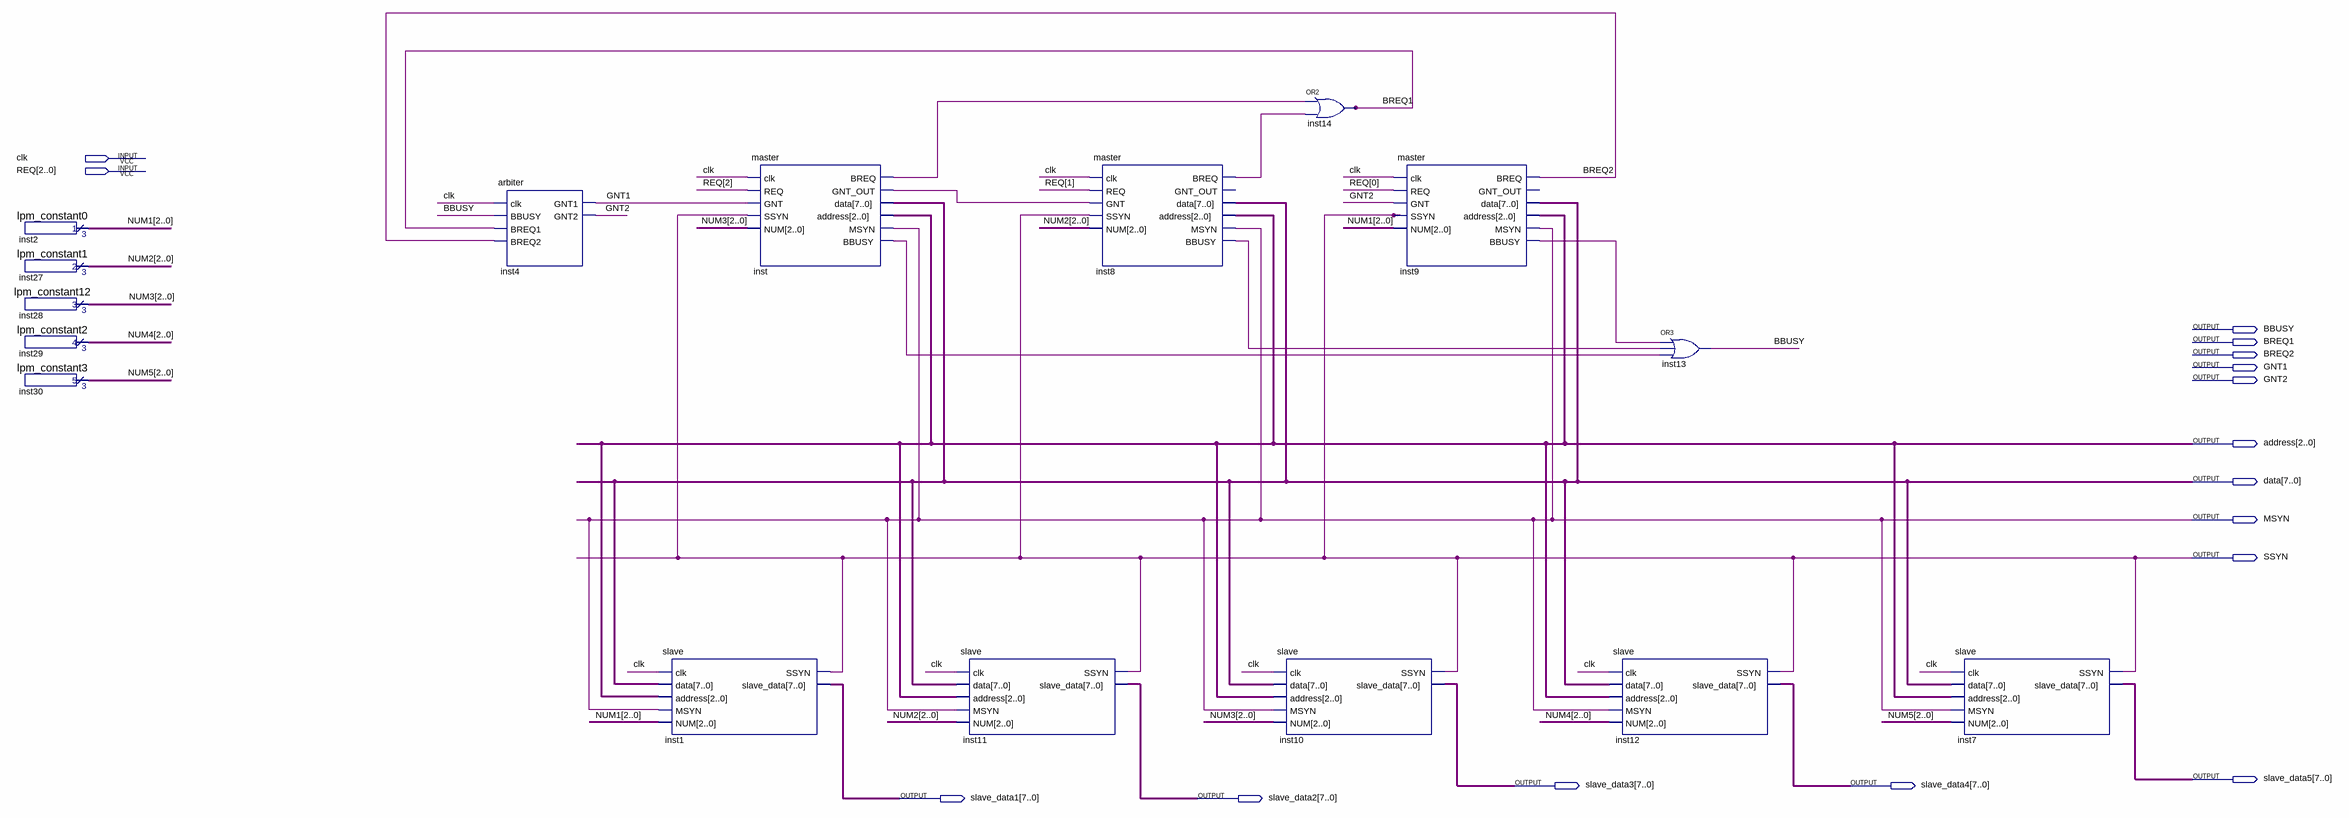
[diagram p0: schematic sheet]
// Quartus schematic main.bdf as structural Verilog: 16 symbols, 16 pins
module main (
  input  clk,
  input  [2:0] REQ,
  output BBUSY,
  output BREQ1,
  output BREQ2,
  output GNT1,
  output GNT2,
  output [2:0] address,
  output [7:0] data,
  output MSYN,
  output SSYN,
  output [7:0] slave_data5,
  output [7:0] slave_data3,
  output [7:0] slave_data4,
  output [7:0] slave_data1,
  output [7:0] slave_data2
);

  wire inst8_bbusy, inst8_breq, inst9_bbusy, inst_bbusy, inst_breq, inst_gnt_out;
  wire [2:0] NUM1, NUM2, NUM3, NUM4, NUM5;

  lpm_constant0 inst2 (.result(NUM1));
  lpm_constant1 inst27 (.result(NUM2));
  lpm_constant12 inst28 (.result(NUM3));
  lpm_constant2 inst29 (.result(NUM4));
  lpm_constant3 inst30 (.result(NUM5));
  arbiter inst4 (.clk(clk), .BBUSY(BBUSY), .BREQ1(BREQ1), .BREQ2(BREQ2), .GNT1(GNT1), .GNT2(GNT2));
  slave inst1 (
    .clk(clk), .data(data), .address(address), .MSYN(MSYN), .NUM(NUM1), .SSYN(SSYN), .slave_data(slave_data1));
  master inst (
    .clk(clk), .REQ(REQ[2]), .GNT(GNT1), .SSYN(SSYN), .NUM(NUM3), .BREQ(inst_breq), .GNT_OUT(inst_gnt_out),
    .data(data), .address(address), .MSYN(MSYN), .BBUSY(inst_bbusy));
  slave inst11 (
    .clk(clk), .data(data), .address(address), .MSYN(MSYN), .NUM(NUM2), .SSYN(SSYN), .slave_data(slave_data2));
  master inst8 (
    .clk(clk), .REQ(REQ[1]), .GNT(inst_gnt_out), .SSYN(SSYN), .NUM(NUM2), .BREQ(inst8_breq), .data(data),
    .address(address), .MSYN(MSYN), .BBUSY(inst8_bbusy));  // open: GNT_OUT
  or inst14 (BREQ1, inst_breq, inst8_breq);
  slave inst10 (
    .clk(clk), .data(data), .address(address), .MSYN(MSYN), .NUM(NUM3), .SSYN(SSYN), .slave_data(slave_data3));
  master inst9 (
    .clk(clk), .REQ(REQ[0]), .GNT(GNT2), .SSYN(SSYN), .NUM(NUM1), .BREQ(BREQ2), .data(data),
    .address(address), .MSYN(MSYN), .BBUSY(inst9_bbusy));  // open: GNT_OUT
  slave inst12 (
    .clk(clk), .data(data), .address(address), .MSYN(MSYN), .NUM(NUM4), .SSYN(SSYN), .slave_data(slave_data4));
  or inst13 (BBUSY, inst9_bbusy, inst8_bbusy, inst_bbusy);
  slave inst7 (
    .clk(clk), .data(data), .address(address), .MSYN(MSYN), .NUM(NUM5), .SSYN(SSYN), .slave_data(slave_data5));
endmodule
